# Altium schematic sheet Science_Board_Top_Level.SchDoc
size B; SheetNumber: 1; SheetTotal: 8
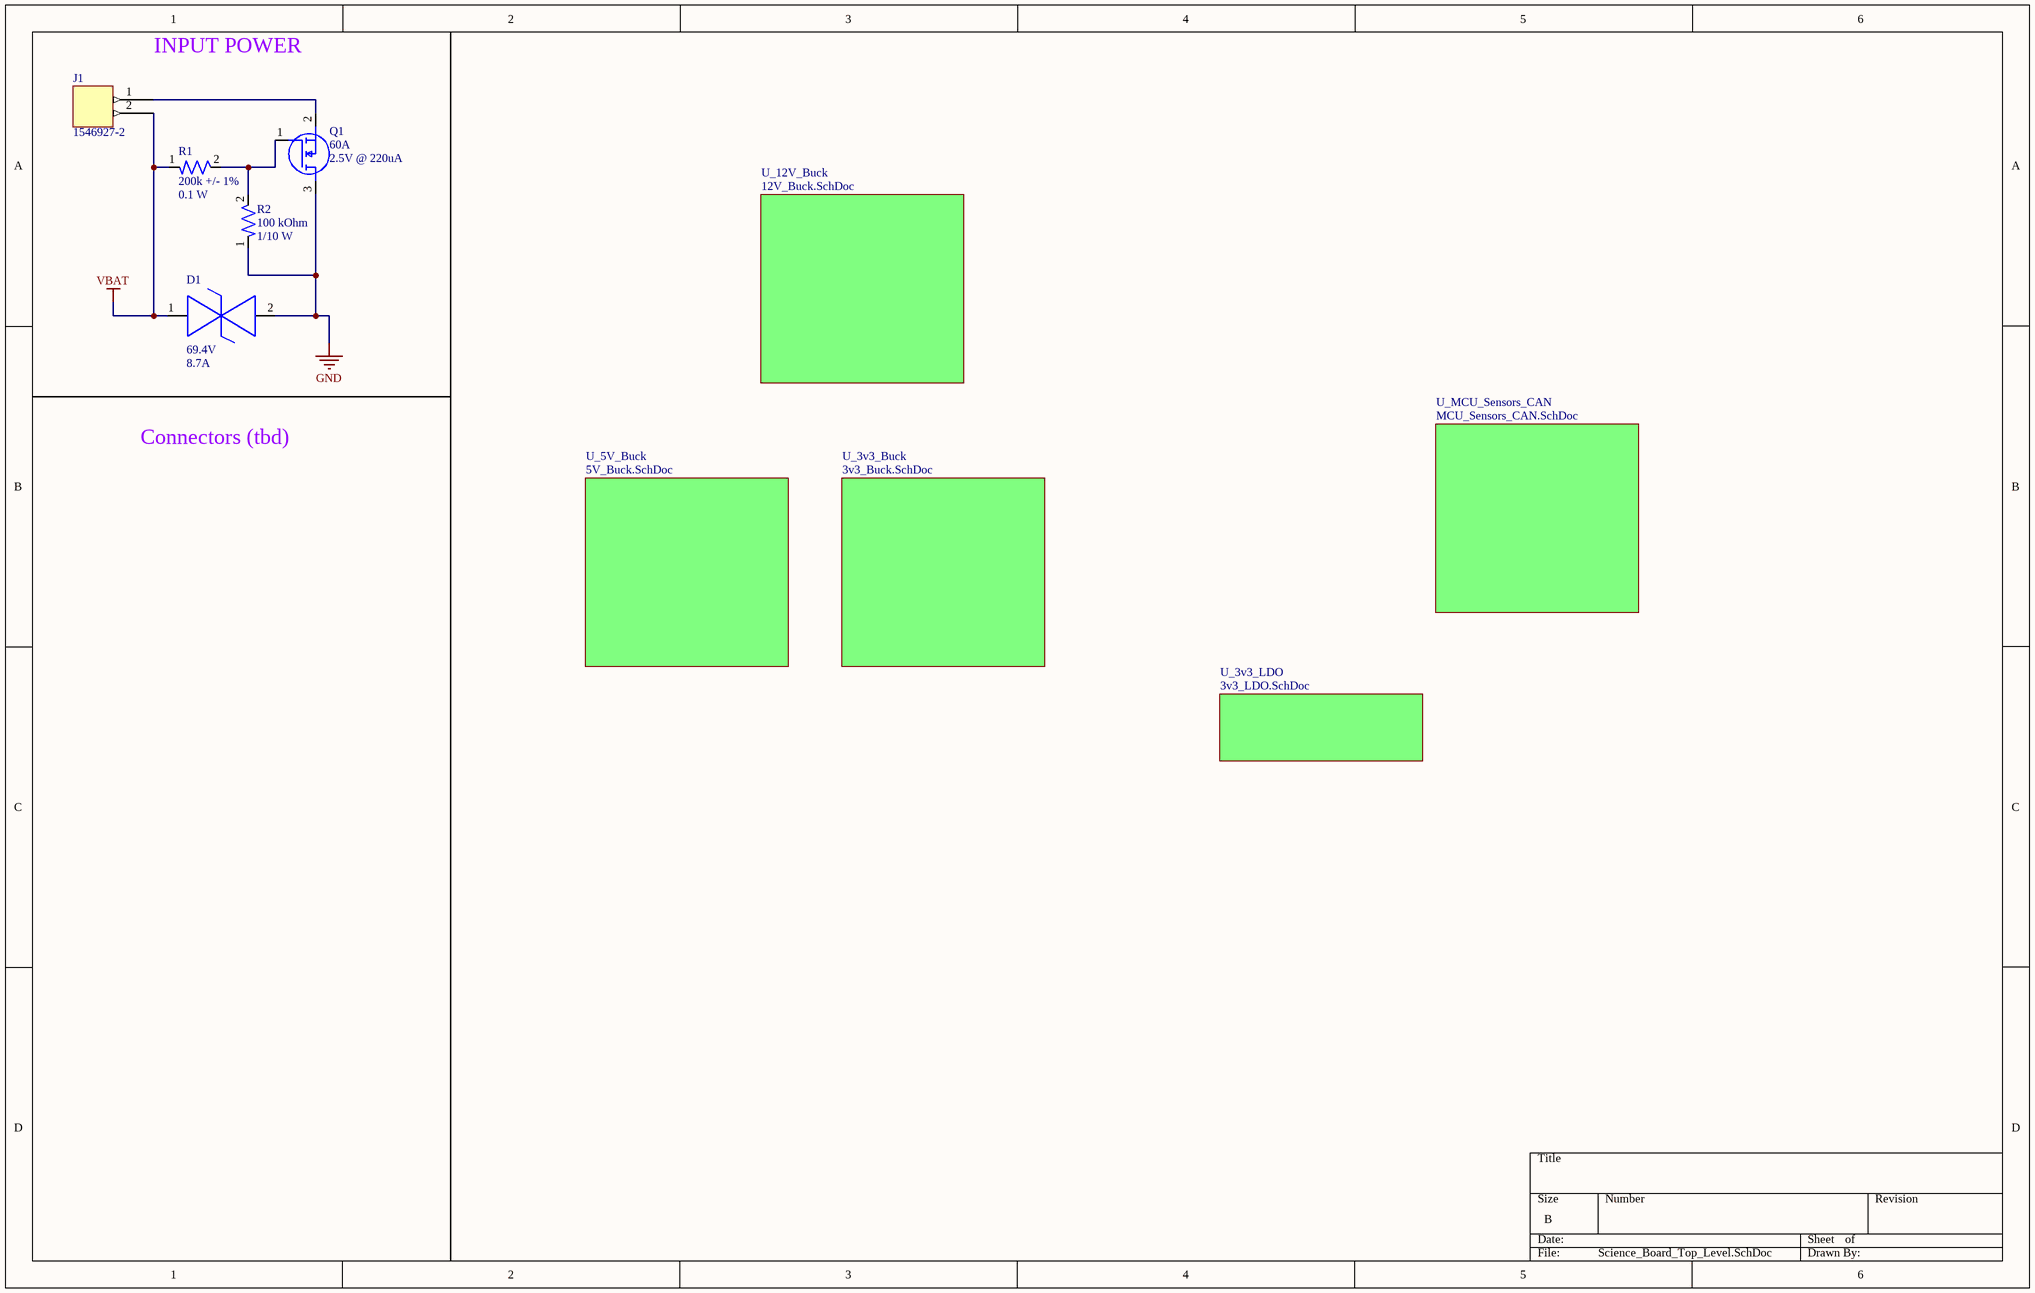
[diagram p0: Science_Board_Top_Level.SchDoc]

## Parts
D1  Vclamp: 69.4V  Peak pulser current: 8.7A  [DO-214AA (SMBJ)]  (hidden comment: SMBJE43CAH)
J1  1546927-2  [CONN-1546927-2]
Q1  Drain Current: 60A  Vgs: 2.5V @ 220uA  [NMOS-8PowerVDFN]  (hidden comment: TPH7R006PL,L1Q)
R1  Resistance: 200k +/- 1%  Power Rating: 0.1 W  [RES-0603]  (hidden comment: ERJ-3EKF2003V)
R2  Resistance: 100 kOhm  Power: 1/10 W  [RES-0603]  (hidden comment: RC0603FR-07100KL)

## Sub-sheets
U_3v3_Buck = 3v3_Buck.SchDoc: no entries
U_3v3_LDO = 3v3_LDO.SchDoc: no entries
U_5V_Buck = 5V_Buck.SchDoc: no entries
U_12V_Buck = 12V_Buck.SchDoc: no entries
U_MCU_Sensors_CAN = MCU_Sensors_CAN.SchDoc: no entries

## Nets
GND: D1.2 Q1.3(D) R2.1
VBAT: D1.1 J1.2 R1.1
NetJ1_1: J1.1 Q1.2(S)
NetQ1_1: Q1.1(G) R1.2 R2.2

## Notes on the sheet
- INPUT POWER
- Connectors (tbd)

## Library data of the parts
D1 = DIO-69.4V-0001: 69.4V Clamp 8.7A Ipp Tvs Diode Surface Mount DO-214AA (SMBJ); Channels: Bidirectional; Breakdown VOltage: 47.8V; Reverse working maximum voltage: 43V; Package: DO-214AA (SMBJ)
J1 = CON-2POS-0003
Q1 = NMOS-60A-0001: N-Channel 60 V 60A (Tc) 81W (Tc) Surface Mount 8-SOP Advance (5x5); Vdss: 60V; Vgs(Max): 20V; Package: 8-PowerVDFN
R1 = RES-200K-0001: 200 kOhms ±1% 0.1W, 1/10W Chip Resistor 0603 (1608 Metric) Automotive AEC-Q200 Thick Film; Manufacturer: Panasonic Electronic Components; Assembled?: Yes; MFP: ERJ-3EKF2003V; Package SIze: 0603
R2 = RES-100K-0003: 100 kOhms ±1% 0.1W, 1/10W Chip Resistor 0603 (1608 Metric) Moisture Resistant Thick Film; Tolerance: +/- 1%; Assembled?: No; Package Size: 0603